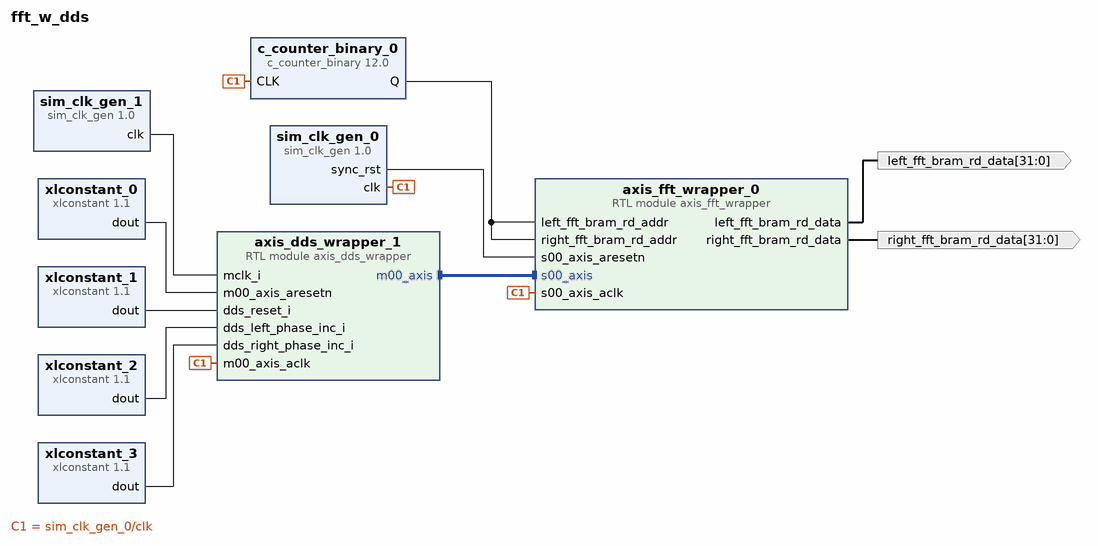
[diagram p0: block diagram of the top level]
# Vivado block design fft_w_dds, xc7z010clg400-1, Vivado 2021.2
create_bd_design fft_w_dds

create_bd_port -dir O -from 31 -to 0 left_fft_bram_rd_data
create_bd_port -dir O -from 31 -to 0 right_fft_bram_rd_data

create_bd_cell -type ip -vlnv xilinx.com:ip:sim_clk_gen:1.0 sim_clk_gen_0
create_bd_cell -type ip -vlnv xilinx.com:ip:sim_clk_gen:1.0 sim_clk_gen_1
set_property -dict {CONFIG.FREQ_HZ 12288000} [get_bd_cells sim_clk_gen_1]
create_bd_cell -type ip -vlnv xilinx.com:ip:xlconstant:1.1 xlconstant_0
create_bd_cell -type ip -vlnv xilinx.com:ip:xlconstant:1.1 xlconstant_1
set_property -dict {CONFIG.CONST_VAL 0 CONFIG.CONST_WIDTH 1} [get_bd_cells xlconstant_1]
create_bd_cell -type ip -vlnv xilinx.com:ip:xlconstant:1.1 xlconstant_2
set_property -dict {CONFIG.CONST_VAL 50 CONFIG.CONST_WIDTH 12} [get_bd_cells xlconstant_2]
create_bd_cell -type module -reference axis_dds_wrapper axis_dds_wrapper_1
set_property -dict {CONFIG.FFT_WINDOW_SIZE 256} [get_bd_cells axis_dds_wrapper_1]
create_bd_cell -type ip -vlnv xilinx.com:ip:c_counter_binary:12.0 c_counter_binary_0
set_property -dict {CONFIG.Output_Width 8 CONFIG.Restrict_Count false} [get_bd_cells c_counter_binary_0]
create_bd_cell -type ip -vlnv xilinx.com:ip:xlconstant:1.1 xlconstant_3
set_property -dict {CONFIG.CONST_VAL 223 CONFIG.CONST_WIDTH 12} [get_bd_cells xlconstant_3]
create_bd_cell -type module -reference axis_fft_wrapper axis_fft_wrapper_0
set_property -dict {CONFIG.FFT_FRAME_SIZE 256 CONFIG.LR_INDEX 31} [get_bd_cells axis_fft_wrapper_0]

# ---- connections ----

connect_bd_intf_net [get_bd_intf_pins axis_dds_wrapper_1/m00_axis] [get_bd_intf_pins axis_fft_wrapper_0/s00_axis]
connect_bd_net [get_bd_pins axis_fft_wrapper_0/left_fft_bram_rd_data] [get_bd_ports left_fft_bram_rd_data]
connect_bd_net [get_bd_pins axis_fft_wrapper_0/right_fft_bram_rd_data] [get_bd_ports right_fft_bram_rd_data]
connect_bd_net [get_bd_pins c_counter_binary_0/Q] \
  [get_bd_pins axis_fft_wrapper_0/left_fft_bram_rd_addr] [get_bd_pins axis_fft_wrapper_0/right_fft_bram_rd_addr]
connect_bd_net [get_bd_pins sim_clk_gen_0/clk] \
  [get_bd_pins axis_dds_wrapper_1/m00_axis_aclk] [get_bd_pins c_counter_binary_0/CLK] \
  [get_bd_pins axis_fft_wrapper_0/s00_axis_aclk]
connect_bd_net [get_bd_pins sim_clk_gen_0/sync_rst] [get_bd_pins axis_fft_wrapper_0/s00_axis_aresetn]
connect_bd_net [get_bd_pins sim_clk_gen_1/clk] [get_bd_pins axis_dds_wrapper_1/mclk_i]
connect_bd_net [get_bd_pins xlconstant_0/dout] [get_bd_pins axis_dds_wrapper_1/m00_axis_aresetn]
connect_bd_net [get_bd_pins xlconstant_1/dout] [get_bd_pins axis_dds_wrapper_1/dds_reset_i]
connect_bd_net [get_bd_pins xlconstant_2/dout] [get_bd_pins axis_dds_wrapper_1/dds_left_phase_inc_i]
connect_bd_net [get_bd_pins xlconstant_3/dout] [get_bd_pins axis_dds_wrapper_1/dds_right_phase_inc_i]

validate_bd_design
save_bd_design
